# Altium schematic sheet FRONT_CONN.SchDoc
size A3; SheetNumber: 3; SheetTotal: 8
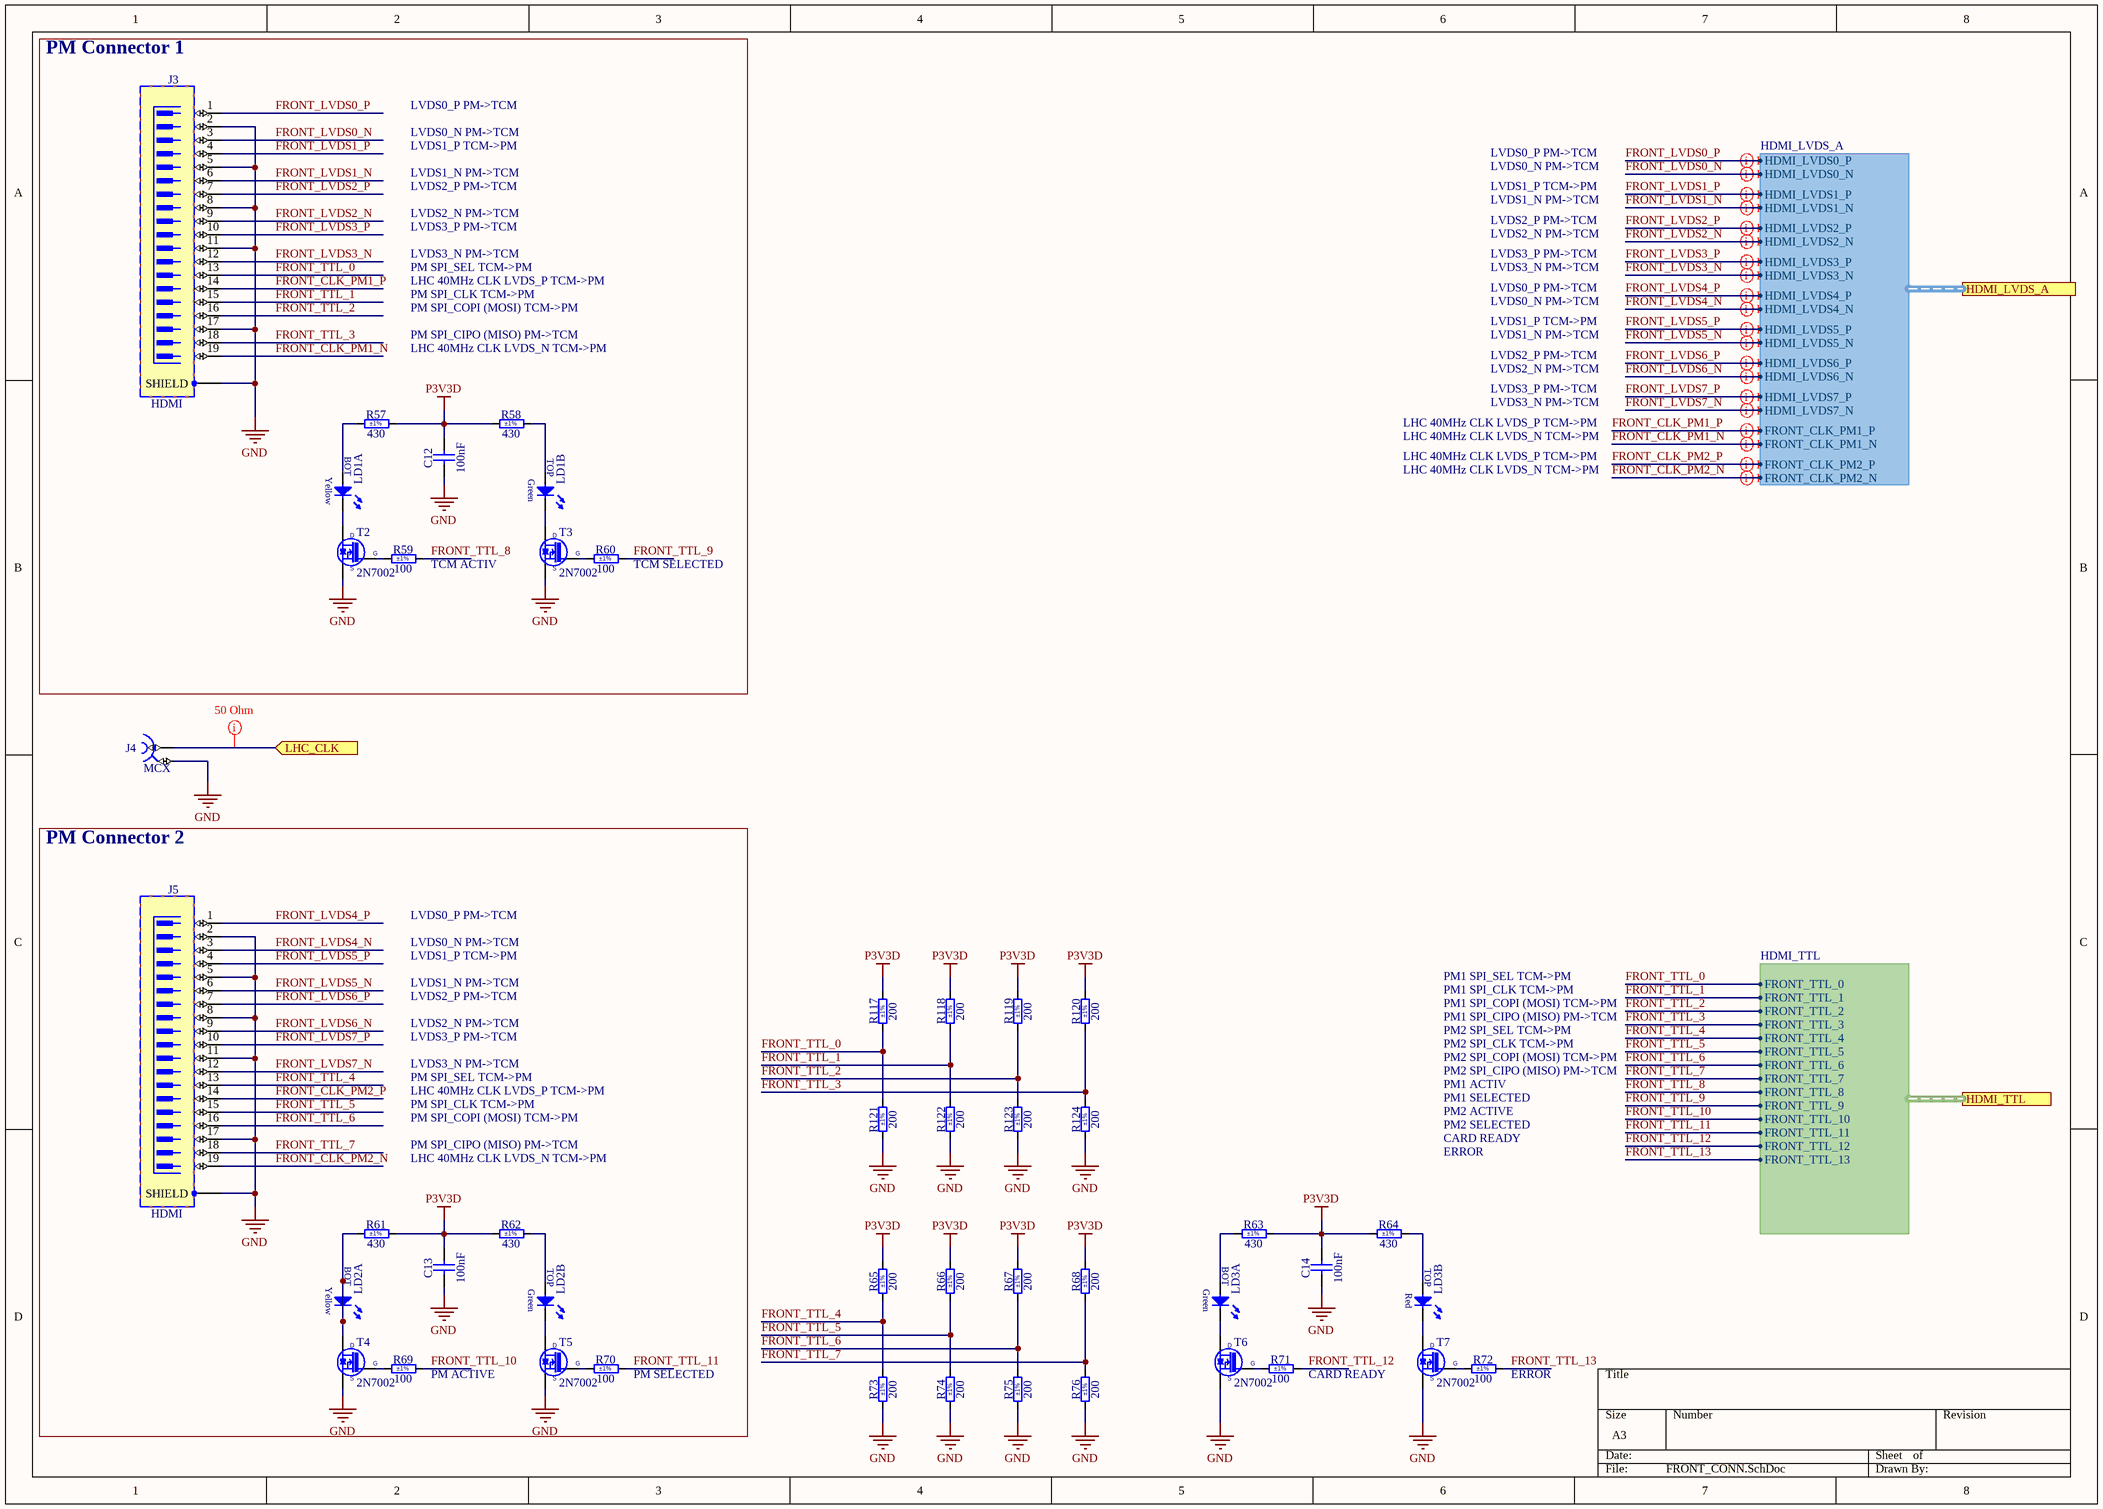
[diagram p0: FRONT_CONN.SchDoc]

## Parts
C12  100nF  [CAPC1608X87N]
C13  100nF  [CAPC1608X87N]
C14  100nF  [CAPC1608X87N]
J3  HDMI  [TYCO_2007435-1]
J4  MCX  [AMPHENOL_919-383J-51A]
J5  HDMI  [TYCO_2007435-1]
LD1  Green/Yellow  [LED_DIALIGHT_571-0123F]  (value not drawn)  (parts A,B of 2)
LD2  Green/Yellow  [LED_DIALIGHT_571-0123F]  (value not drawn)  (parts A,B of 2)
LD3  Red/Green  [LED_DIALIGHT_571-0112-100F]  (value not drawn)  (parts A,B of 2)
R57  430  Tolerance: ±1%  [RESC1608X55N]
R58  430  Tolerance: ±1%  [RESC1608X55N]
R59  100  Tolerance: ±1%  [RESC1608X55N]
R60  100  Tolerance: ±1%  [RESC1608X55N]
R61  430  Tolerance: ±1%  [RESC1608X55N]
R62  430  Tolerance: ±1%  [RESC1608X55N]
R63  430  Tolerance: ±1%  [RESC1608X55N]
R64  430  Tolerance: ±1%  [RESC1608X55N]
R65  200  Tolerance: ±1%  [RESC1608X55N]
R66  200  Tolerance: ±1%  [RESC1608X55N]
R67  200  Tolerance: ±1%  [RESC1608X55N]
R68  200  Tolerance: ±1%  [RESC1608X55N]
R69  100  Tolerance: ±1%  [RESC1608X55N]
R70  100  Tolerance: ±1%  [RESC1608X55N]
R71  100  Tolerance: ±1%  [RESC1608X55N]
R72  100  Tolerance: ±1%  [RESC1608X55N]
R73  200  Tolerance: ±1%  [RESC1608X55N]
R74  200  Tolerance: ±1%  [RESC1608X55N]
R75  200  Tolerance: ±1%  [RESC1608X55N]
R76  200  Tolerance: ±1%  [RESC1608X55N]
R117  200  Tolerance: ±1%  [RESC1608X55N]
R118  200  Tolerance: ±1%  [RESC1608X55N]
R119  200  Tolerance: ±1%  [RESC1608X55N]
R120  200  Tolerance: ±1%  [RESC1608X55N]
R121  200  Tolerance: ±1%  [RESC1608X55N]
R122  200  Tolerance: ±1%  [RESC1608X55N]
R123  200  Tolerance: ±1%  [RESC1608X55N]
R124  200  Tolerance: ±1%  [RESC1608X55N]
T2  2N7002  [SOT95P240X130-3N]
T3  2N7002  [SOT95P240X130-3N]
T4  2N7002  [SOT95P240X130-3N]
T5  2N7002  [SOT95P240X130-3N]
T6  2N7002  [SOT95P240X130-3N]
T7  2N7002  [SOT95P240X130-3N]

## Blocks framed on the sheet
PM Connector 1: C12 J3 LD1 R57-R60 T2 T3
PM Connector 2: C13 J5 LD2 R61 R62 R69 R70 T4 T5

## Ports
HDMI_LVDS_A (harness HDMI_LVDS_A, see BLOCK_DIAGRAM[1B], REDRIVERS[8A]), HDMI_TTL (harness HDMI_TTL, see BLOCK_DIAGRAM[1B], REDRIVERS[8C]), LHC_CLK (in, see BLOCK_DIAGRAM[1B])

## Harnesses
HDMI_TTL: FRONT_TTL_0, FRONT_TTL_1, FRONT_TTL_2, FRONT_TTL_3, FRONT_TTL_4, FRONT_TTL_5, FRONT_TTL_6, FRONT_TTL_7, FRONT_TTL_8, FRONT_TTL_9, FRONT_TTL_10, FRONT_TTL_11, FRONT_TTL_12, FRONT_TTL_13
HDMI_LVDS_A: HDMI_LVDS0_P, HDMI_LVDS0_N, HDMI_LVDS1_P, HDMI_LVDS1_N, HDMI_LVDS2_P, HDMI_LVDS2_N, HDMI_LVDS3_P, HDMI_LVDS3_N, HDMI_LVDS4_P, HDMI_LVDS4_N, HDMI_LVDS5_P, HDMI_LVDS5_N, HDMI_LVDS6_P, HDMI_LVDS6_N, HDMI_LVDS7_P, HDMI_LVDS7_N, FRONT_CLK_PM1_P, FRONT_CLK_PM1_N, FRONT_CLK_PM2_P, FRONT_CLK_PM2_N

## Nets
GND: C12.1 C13.1 C14.1 J3.2 J3.5 J3.8 J3.11 J3.17 J3.SHIELD J4.2 J5.2 J5.5 J5.8 J5.11 J5.17 J5.SHIELD R73.1 R74.1 R75.1 R76.1 R121.1 R122.1 R123.1 R124.1 T2.2(S) T3.2(S) T4.2(S) T5.2(S) T6.2(S) T7.2(S)
P3V3D: C12.2 C13.2 C14.2 R57.2 R58.1 R61.2 R62.1 R63.2 R64.1 R65.2 R66.2 R67.2 R68.2 R117.2 R118.2 R119.2 R120.2
FRONT_CLK_PM1_N: J3.19 ; port HDMI_LVDS_A.FRONT_CLK_PM1_N
FRONT_CLK_PM1_P: J3.14 ; port HDMI_LVDS_A.FRONT_CLK_PM1_P
FRONT_CLK_PM2_N: J5.19 ; port HDMI_LVDS_A.FRONT_CLK_PM2_N
FRONT_CLK_PM2_P: J5.14 ; port HDMI_LVDS_A.FRONT_CLK_PM2_P
FRONT_LVDS0_N: J3.3 ; port HDMI_LVDS_A.HDMI_LVDS0_N
FRONT_LVDS0_P: J3.1 ; port HDMI_LVDS_A.HDMI_LVDS0_P
FRONT_LVDS1_N: J3.6 ; port HDMI_LVDS_A.HDMI_LVDS1_N
FRONT_LVDS1_P: J3.4 ; port HDMI_LVDS_A.HDMI_LVDS1_P
FRONT_LVDS2_N: J3.9 ; port HDMI_LVDS_A.HDMI_LVDS2_N
FRONT_LVDS2_P: J3.7 ; port HDMI_LVDS_A.HDMI_LVDS2_P
FRONT_LVDS3_N: J3.12 ; port HDMI_LVDS_A.HDMI_LVDS3_N
FRONT_LVDS3_P: J3.10 ; port HDMI_LVDS_A.HDMI_LVDS3_P
FRONT_LVDS4_N: J5.3 ; port HDMI_LVDS_A.HDMI_LVDS4_N
FRONT_LVDS4_P: J5.1 ; port HDMI_LVDS_A.HDMI_LVDS4_P
FRONT_LVDS5_N: J5.6 ; port HDMI_LVDS_A.HDMI_LVDS5_N
FRONT_LVDS5_P: J5.4 ; port HDMI_LVDS_A.HDMI_LVDS5_P
FRONT_LVDS6_N: J5.9 ; port HDMI_LVDS_A.HDMI_LVDS6_N
FRONT_LVDS6_P: J5.7 ; port HDMI_LVDS_A.HDMI_LVDS6_P
FRONT_LVDS7_N: J5.12 ; port HDMI_LVDS_A.HDMI_LVDS7_N
FRONT_LVDS7_P: J5.10 ; port HDMI_LVDS_A.HDMI_LVDS7_P
FRONT_TTL_0: J3.13 R117.1 R121.2 ; port HDMI_TTL.FRONT_TTL_0
FRONT_TTL_1: J3.15 R118.1 R122.2 ; port HDMI_TTL.FRONT_TTL_1
FRONT_TTL_2: J3.16 R119.1 R123.2 ; port HDMI_TTL.FRONT_TTL_2
FRONT_TTL_3: J3.18 R120.1 R124.2 ; port HDMI_TTL.FRONT_TTL_3
FRONT_TTL_4: J5.13 R65.1 R73.2 ; port HDMI_TTL.FRONT_TTL_4
FRONT_TTL_5: J5.15 R66.1 R74.2 ; port HDMI_TTL.FRONT_TTL_5
FRONT_TTL_6: J5.16 R67.1 R75.2 ; port HDMI_TTL.FRONT_TTL_6
FRONT_TTL_7: J5.18 R68.1 R76.2 ; port HDMI_TTL.FRONT_TTL_7
FRONT_TTL_8: R59.2 ; port HDMI_TTL.FRONT_TTL_8
FRONT_TTL_9: R60.2 ; port HDMI_TTL.FRONT_TTL_9
FRONT_TTL_10: R69.2 ; port HDMI_TTL.FRONT_TTL_10
FRONT_TTL_11: R70.2 ; port HDMI_TTL.FRONT_TTL_11
FRONT_TTL_12: R71.2 ; port HDMI_TTL.FRONT_TTL_12
FRONT_TTL_13: R72.2 ; port HDMI_TTL.FRONT_TTL_13
LHC_CLK: J4.1 ; port LHC_CLK
NetLD1_1: LD1.1(C) T2.3(D)
NetLD1_2: LD1.2(A) R57.1
NetLD1_3: LD1.3(C) T3.3(D)
NetLD1_4: LD1.4(A) R58.2
NetLD2_1: LD2.1(C) LD2.2(A) R61.1 T4.3(D)
NetLD2_3: LD2.3(C) T5.3(D)
NetLD2_4: LD2.4(A) R62.2
NetLD3_1: LD3.1(C) T6.3(D)
NetLD3_2: LD3.2(A) R63.1
NetLD3_3: LD3.3(C) T7.3(D)
NetLD3_4: LD3.4(A) R64.2
NetR59_1: R59.1 T2.1(G)
NetR60_1: R60.1 T3.1(G)
NetR69_1: R69.1 T4.1(G)
NetR70_1: R70.1 T5.1(G)
NetR71_1: R71.1 T6.1(G)
NetR72_1: R72.1 T7.1(G)

## Layout directives
differential pair; net class LVDS; differential pair class LVDS_DIFF: FRONT_CLK_PM1_N, FRONT_CLK_PM1_P, FRONT_CLK_PM2_N, FRONT_CLK_PM2_P, FRONT_LVDS0_N, FRONT_LVDS0_P, FRONT_LVDS1_N, FRONT_LVDS1_P, FRONT_LVDS2_N, FRONT_LVDS2_P, FRONT_LVDS3_N, FRONT_LVDS3_P, FRONT_LVDS4_N, FRONT_LVDS4_P, FRONT_LVDS5_N, FRONT_LVDS5_P, FRONT_LVDS6_N, FRONT_LVDS6_P, FRONT_LVDS7_N, FRONT_LVDS7_P
net class CLK: LHC_CLK

## Notes on the sheet
- LVDS0_P PM->TCM
- LVDS0_N PM->TCM
- LVDS1_P TCM->PM
- LVDS1_N PM->TCM
- LVDS2_P PM->TCM
- LVDS2_N PM->TCM
- LVDS3_P PM->TCM
- LVDS3_N PM->TCM
- PM SPI_SEL TCM->PM
- LHC 40MHz CLK LVDS_P TCM->PM
- PM SPI_CLK TCM->PM
- PM SPI_COPI (MOSI) TCM->PM
- PM SPI_CIPO (MISO) PM->TCM
- LHC 40MHz CLK LVDS_N TCM->PM
- (near R59) TCM ACTIV
- (near R60) TCM SELECTED
- PM1 SPI_SEL TCM->PM
- PM1 SPI_CLK TCM->PM
- PM1 SPI_COPI (MOSI) TCM->PM
- PM1 SPI_CIPO (MISO) PM->TCM
- PM2 SPI_SEL TCM->PM
- PM2 SPI_CLK TCM->PM
- PM1 ACTIV
- PM1 SELECTED
- PM2 ACTIVE
- PM2 SELECTED
- PM2 SPI_COPI (MOSI) TCM->PM
- PM2 SPI_CIPO (MISO) PM->TCM
- CARD READY
- ERROR
- (near R69) PM ACTIVE
- (near R70) PM SELECTED
- (near R71) CARD READY
- (near R72) ERROR
- (in symbol LED_DIALIGHT_571-0112-100F, part A) BOT; Green
- (in symbol LED_DIALIGHT_571-0112-100F, part B) TOP; Red
- (in symbol LED_DIALIGHT_571-0123F, part A) BOT; Yellow
- (in symbol LED_DIALIGHT_571-0123F, part B) TOP; Green

## Library data of the parts
C12-C14 = CC0603_100NF_50V_10%_X7R: Non-polarised capacitor; Part Description: SMD Multilayer Chip Ceramic Capacitor; Manufacturer: GENERIC; Manufacturer1 Part Number: 223858615649; Voltage: 50V; TC: X7R; Tolerance: ±10%; Part Number: CC0603_100NF_50V_10%_X7R; Component Kind: Standard; Component Type: Standard; Pin Count: 2; Value: 100nF; Status: Preferred; Manufacturer Part Number: CC0603_100NF_50V_10%_X7R; Case: 0603; Mounted: Yes; Socket: No; SMD: Yes; Sense: No; Manufacturer1 Example: PHYCOMP; Manufacturer1 ComponentHeight: 0.87mm; HelpURL: \\cern.ch\dfs\Applications\Altium\Datasheets\CC0603_X7R_PHYCOMP.pdf; Author: CERN DEM JLC; CreateDate: 03.12.2007; LatestRevisionDate: 03.12.2007
J3 J5 = TYCO_2007435-1: Connector HDMI 19 Male + 1 Shield; Part Description: 0.578mm Pitch, Through-Hole Right Angle 19 Contacts Flag-HDMI Type-A Receptacle Thru Hole Mounting Pads; Manufacturer: TYCO ELECTRONICS; PressFit: No; Part Number: TYCO_2007435-1; Component Kind: Standard; Component Type: Standard; Pin Count: 23; Family: HDMI; Mounted: Yes; Socket: No; SMD: No; Sense: No; Status: None; Manufacturer Part Number: 2007435-1; ComponentHeight: 16.4mm; HelpURL: \\cern.ch\dfs\Applications\Altium\Datasheets\TYCO_2007435-1.pdf; Author: CERN DEM MR; CreateDate: 05.07.2016; LatestRevisionDate: 05.07.2016
J4 = AMPHENOL_919-383J-51A: Part Description: 50 Ohms, RF Connector, MCX Right Angle PCB Receptacle Jack; PressFit: No; Part Number: AMPHENOL_919-383J-51A; Component Kind: Standard; Component Type: Standard; Pin Count: 5; Family: MCX; Mounted: Yes; Socket: No; SMD: No; Sense: No; Status: None; Manufacturer: AMPHENOL; Manufacturer Part Number: 919-383J-51A; ComponentHeight: 6mm; HelpURL: \\cern.ch\dfs\Applications\Altium\Datasheets\AMPHENOL_919-383J-51A.pdf; Author: CERN DEM BC; CreateDate: 31.01.2019; LatestRevisionDate: 31.01.2019
LD1 LD2 = LED_DIALIGHT_571-0123F: 2x LED  Botom Yellow, Top Green; Part Description: Dual 2mm  LEDs, Green Top, Yellow Bot, CBI® Circuit Board Indicator (without positioning pins); PressFit: No; Bonding: No; Part Number: LED_DIALIGHT_571-0123F; Component Kind: Standard; Component Type: Standard; Color: Green/Yellow; PackageDescription: 2x 2mm LED (Top: Green, Bot: Yellow) PCB Edge Mounting (without positioning pins) DIALIGHT 571 Serie; Manufacturer: DIALIGHT; Manufacturer Part Number: 571-0123F; Pin Count: 4; Mounted: Yes; Socket: No; SMD: No; Sense: No; ComponentHeight: 8.6mm; HelpURL: \\cern.ch\dfs\Applications\Altium\Datasheets\LED_DIALIGHT_571-0123F.pdf; Author: CERN DEM JLC; CreateDate: 17.07.2014; LatestRevisionDate: 17.07.2014
LD3 = LED_DIALIGHT_571-0112-100F: 2x LED Botom Green, Top Red; Part Description: Dual 2mm  LEDs, Red Top,Green Bot, CBI® Circuit Board Indicator (with positioning pins); PressFit: No; Bonding: No; Part Number: LED_DIALIGHT_571-0112-100F; Component Kind: Standard; Component Type: Standard; Color: Red/Green; PackageDescription: 2x 2mm LED (Top: Red, Bot: Green) PCB Edge Mounting (with positioning pins) DIALIGHT 571 Serie; Manufacturer: DIALIGHT; Manufacturer Part Number: 571-0112-100F; Pin Count: 4; Mounted: Yes; Socket: No; SMD: No; Sense: No; ComponentHeight: 8.6mm; HelpURL: \\cern.ch\dfs\Applications\Altium\Datasheets\LED_DIALIGHT_571-0112-100F.pdf; Author: CERN DEM JLC; CreateDate: 05.11.2009; LatestRevisionDate: 17.03.2010
R57 R58 R61-R64 = R0603_430R_1%_0.1W_100PPM: Resistor - 1%; Part Description: General Purpose Thick Film Chip Resistor; Manufacturer: GENERIC; Manufacturer1 Part Number: NRC06F4300TRF; Power: 0.1W; TC: ±100ppm/°C; PressFit: No; Part Number: R0603_430R_1%_0.1W_100PPM; Component Kind: Standard; Component Type: Standard; Pin Count: 2; Value: 430; Status: Preferred; Manufacturer Part Number: R0603_430R_1%_0.1W_100PPM; Case: 0603; Mounted: Yes; Sense: No; Socket: No; SMD: Yes; Manufacturer1 Example: NIC COMPONENT; Manufacturer1 ComponentHeight: 0.55mm; HelpURL: \\cern.ch\dfs\Applications\Altium\Datasheets\R0603_NIC_NRC.pdf; Author: CERN DEM JLC; CreateDate: 03.12.2007; LatestRevisionDate: 13.03.2008
R59 R60 R69-R72 = R0603_100R_1%_0.1W_100PPM: Resistor - 1%; Part Description: General Purpose Thick Film Chip Resistor; Manufacturer: GENERIC; Manufacturer1 Part Number: NRC06F4700TRF; Power: 0.1W; TC: ±100ppm/°C; PressFit: No; Part Number: R0603_100R_1%_0.1W_100PPM; Component Kind: Standard; Component Type: Standard; Pin Count: 2; Value: 100; Status: Preferred; Manufacturer Part Number: R0603_100R_1%_0.1W_100PPM; Case: 0603; Mounted: Yes; Sense: No; Socket: No; SMD: Yes; Manufacturer1 Example: NIC COMPONENT; Manufacturer1 ComponentHeight: 0.55mm; HelpURL: \\cern.ch\dfs\Applications\Altium\Datasheets\R0603_NIC_NRC.pdf; Author: CERN DEM JLC; CreateDate: 03.12.2007; LatestRevisionDate: 13.03.2008
R65-R68 R73-R76 R117-R124 = R0603_200R_1%_0.1W_100PPM: Resistor - 1%; Part Description: General Purpose Thick Film Chip Resistor; Manufacturer: GENERIC; Manufacturer1 Part Number: NRC06F2000TRF; Power: 0.1W; TC: ±100ppm/°C; PressFit: No; Part Number: R0603_200R_1%_0.1W_100PPM; Component Kind: Standard; Component Type: Standard; Pin Count: 2; Value: 200; Status: Preferred; Manufacturer Part Number: R0603_200R_1%_0.1W_100PPM; Case: 0603; Mounted: Yes; Sense: No; Socket: No; SMD: Yes; Manufacturer1 Example: NIC COMPONENT; Manufacturer1 ComponentHeight: 0.55mm; HelpURL: \\cern.ch\dfs\Applications\Altium\Datasheets\R0603_NIC_NRC.pdf; Author: CERN DEM JLC; CreateDate: 03.12.2007; LatestRevisionDate: 13.03.2008
T2-T7 = 2N7002: N-CHANNEL MOSFET WITH DIODE; Part Description: 60V, 280mA, N-Channel Enhancement Mode Field Effect Transistor (FET); Manufacturer: FAIRCHILD SEMICONDUCTOR; PressFit: No; Bonding: No; Part Number: 2N7002; Component Kind: Standard; Component Type: Standard; Device: 2N7002; PackageDescription: SOT23, 0.95mm Pitch; 3 Pin, 1.30mm W X 2.90mm L X 1.30mm H body, IPC Medium Density; Manufacturer Part Number: 2N7002; Pin Count: 3; Case: SOT23-3; Mounted: Yes; Socket: No; SMD: Yes; Sense: No; ComponentHeight: 1.3mm; HelpURL: \\cern.ch\dfs\Applications\Altium\Datasheets\2N7002.pdf; Author: CERN DEM JLC; CreateDate: 20.08.2008; LatestRevisionDate: 07.04.2009